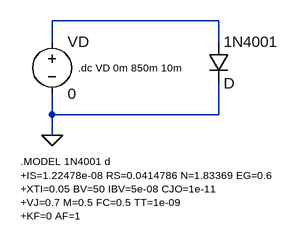
[diagram p0: schematic Diodo 1N4001 (região condução).asc]
Diodo 1N4001 (região condução).asc, the LTspice schematic file:
Version 4
SHEET 1 880 680
WIRE 384 80 128 80
WIRE 128 112 128 80
WIRE 384 112 384 80
WIRE 128 224 128 192
WIRE 384 224 384 176
WIRE 384 224 128 224
WIRE 128 256 128 224
FLAG 128 256 0
SYMBOL diode 368 112 R0
SYMATTR InstName 1N4001
SYMBOL voltage 128 96 R0
WINDOW 123 0 0 Left 0
WINDOW 39 0 0 Left 0
SYMATTR InstName VD
SYMATTR Value 0
TEXT 168 152 Left 1 !.dc VD 0m 850m 10m
TEXT 80 296 Left 1 !.MODEL 1N4001 d\n+IS=1.22478e-08 RS=0.0414786 N=1.83369 EG=0.6\n+XTI=0.05 BV=50 IBV=5e-08 CJO=1e-11\n+VJ=0.7 M=0.5 FC=0.5 TT=1e-09\n+KF=0 AF=1

The netlist it stands for:
* Diodo 1N4001 (região condução).asc
D§1N4001 N001 0 D
VD N001 0 0
.model D D
.lib standard.dio
.dc VD 0m 850m 10m
.MODEL 1N4001 d
+IS=1.22478e-08 RS=0.0414786 N=1.83369 EG=0.6
+XTI=0.05 BV=50 IBV=5e-08 CJO=1e-11
+VJ=0.7 M=0.5 FC=0.5 TT=1e-09
+KF=0 AF=1
.backanno
.end